# EAGLE design stk681ピッチ変換 (EAGLE 5.11)
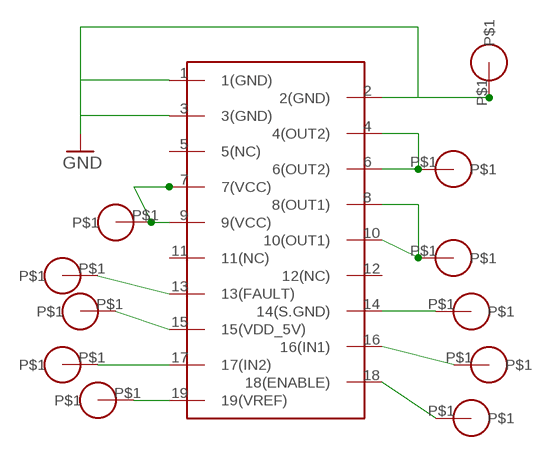
[diagram p0: schematic, sheet 1]

## Parts
ENABLE  1PIN  [1PIN]
FAULT  1PIN  [1PIN]
GND  1PIN  [1PIN]
IN1  1PIN  [1PIN]
IN2  1PIN  [1PIN]
OUT1  1PIN  [1PIN]
OUT2  1PIN  [1PIN]
S.GND  1PIN  [1PIN]
U$1  STK681-332  [STK681-332]
VCC  1PIN  [1PIN]
VDD_5V  1PIN  [1PIN]
VREF  1PIN  [1PIN]

## Nets
GND: GND.P$1 U$1.1(1(GND)) U$1.2(2(GND)) U$1.3(3(GND))
N$2: OUT2.P$1 U$1.4(4(OUT2)) U$1.6(6(OUT2))
N$3: U$1.7(7(VCC)) U$1.9(9(VCC)) VCC.P$1
N$4: OUT1.P$1 U$1.8(8(OUT1)) U$1.10(10(OUT1))
N$6: FAULT.P$1 U$1.13(13(FAULT))
N$7: U$1.15(15(VDD_5V)) VDD_5V.P$1
N$8: IN2.P$1 U$1.17(17(IN2))
N$9: U$1.19(19(VREF)) VREF.P$1
N$10: ENABLE.P$1 U$1.18(18(ENABLE))
N$11: IN1.P$1 U$1.16(16(IN1))
N$12: S.GND.P$1 U$1.14(14(S.GND))
Unconnected: U$1.5(5(NC)) U$1.11(11(NC)) U$1.12(12(NC))

## Library data of the parts
ENABLE FAULT GND IN1 IN2 OUT1 OUT2 S.GND VCC VDD_5V VREF = 1pin:1PIN: 1pin_for_pitchchange
U$1 = STK-681-332:STK681-332: STK681-332e

## Board
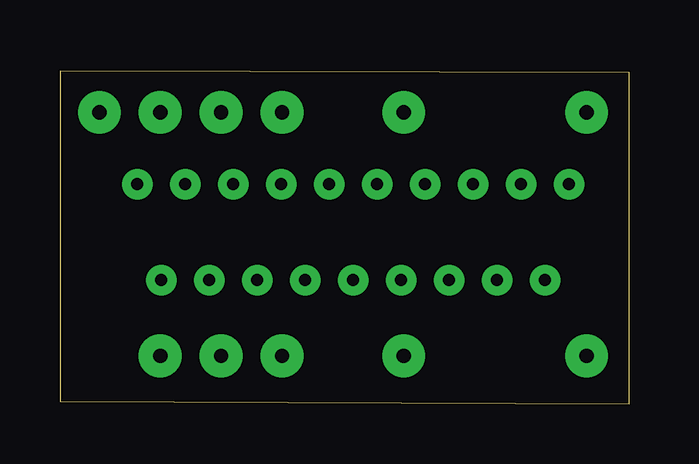
[diagram p1: board, top side]
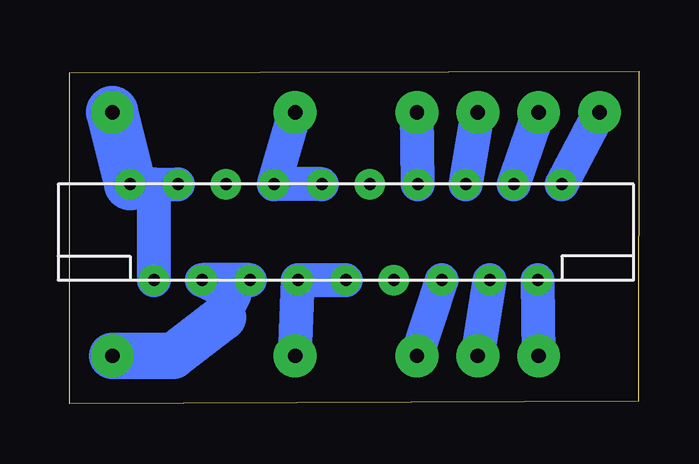
[diagram p2: board, bottom side, seen from below]

Size 23.74 x 13.88 mm. Coordinates in mm from the lower left corner, seen from the top.
Outline: 0.02,0.1 23.74,0 23.74,13.82 0,13.88 0.02,0.1
Copper layers (1*16): Top 0.035mm / dielectric 1.5mm / Bottom 0.035mm
Design rules "default": minimum track width 10mil, minimum drill 24mil, track to track 8mil, track to pad 8mil, pad to pad 8mil, via to via 8mil, smd to smd 8mil, copper to edge 40mil, drill to drill 8mil, minimum pad ring 10mil, minimum via ring 8mil, stop-mask expansion 4mil, vias tented up to drill 0mil, thermal gap 10mil

### Footprints (pad centres in the part's own frame; a part is rotated, then mirrored left to right if it is on the bottom)
1PIN = drill 0.6 pad 1.778 round: P$1 0,0
STK681-332 = drill 0.5 pad 1.27 round: 1 -9,2; 2 -8,-2; 3 -7,2; 4 -6,-2; 5 -5,2; 6 -4,-2; 7 -3,2; 8 -2,-2; 9 -1,2; 10 0,-2; 11 1,2; 12 2,-2; 13 3,2; 14 4,-2; 15 5,2; 16 6,-2; 17 7,2; 18 8,-2; 19 9,2

### Placement (x,y rotation side)
ENABLE  4.18,2 270 top
FAULT  9.26,12.16 0 top
GND  21.96,12.16 270 top
IN1  6.72,2 270 top
IN2  4.18,12.16 270 top
OUT1  14.34,2 270 top
OUT2  21.96,2 270 top
S.GND  9.26,2 0 top
U$1  12.22,7.16 0 bottom
VCC  14.34,12.16 270 top
VDD_5V  6.72,12.16 270 top
VREF  1.64,12.16 270 top

### Tracks (layer width: path | path; a pad name or v marks a point on that pad's centre or on a via)
GND
  Bottom 1.422: U$1.2 20.22,9.16 | 20.22,9.16 U$1.3 | 20.22,9.16 U$1.1
  Bottom 2.184: U$1.1 GND.P$1
N$2
  Bottom 1.422: U$1.6 U$1.4 16.88,4.54 17.34,3.6
  Bottom 1.93: OUT2.P$1 19.42,2 17.34,3.6
N$3
  Bottom 1.422: U$1.9 U$1.7 VCC.P$1
N$4
  Bottom 1.422: U$1.10 U$1.8 OUT1.P$1
N$6
  Bottom 1.422: U$1.13 FAULT.P$1
N$7
  Bottom 1.422: U$1.15 VDD_5V.P$1
N$8
  Bottom 1.422: U$1.17 IN2.P$1
N$9
  Bottom 1.422: U$1.19 VREF.P$1
N$10
  Bottom 1.422: ENABLE.P$1 U$1.18
N$11
  Bottom 1.422: IN1.P$1 U$1.16
N$12
  Bottom 1.422: S.GND.P$1 U$1.14